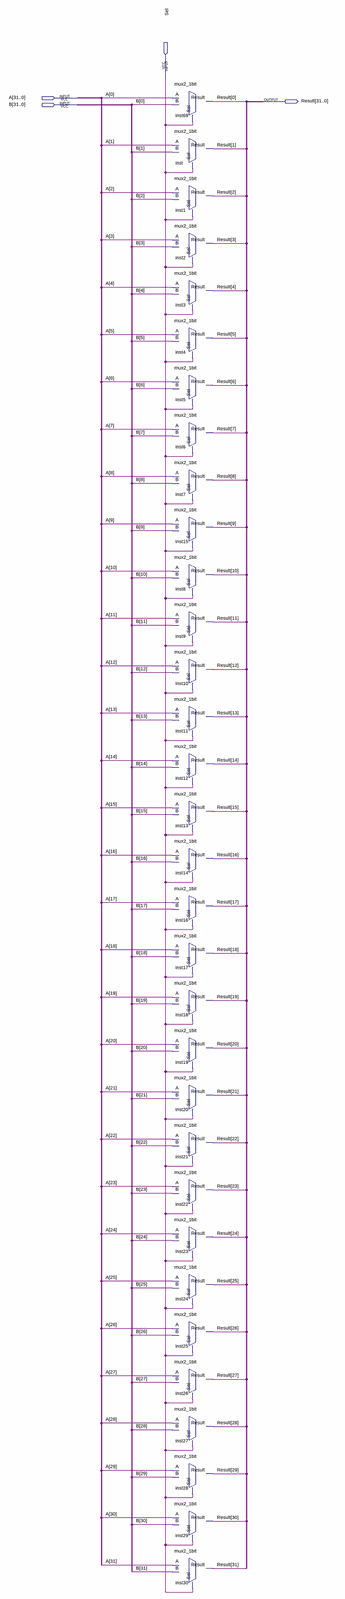
[diagram p0: schematic sheet, whole]
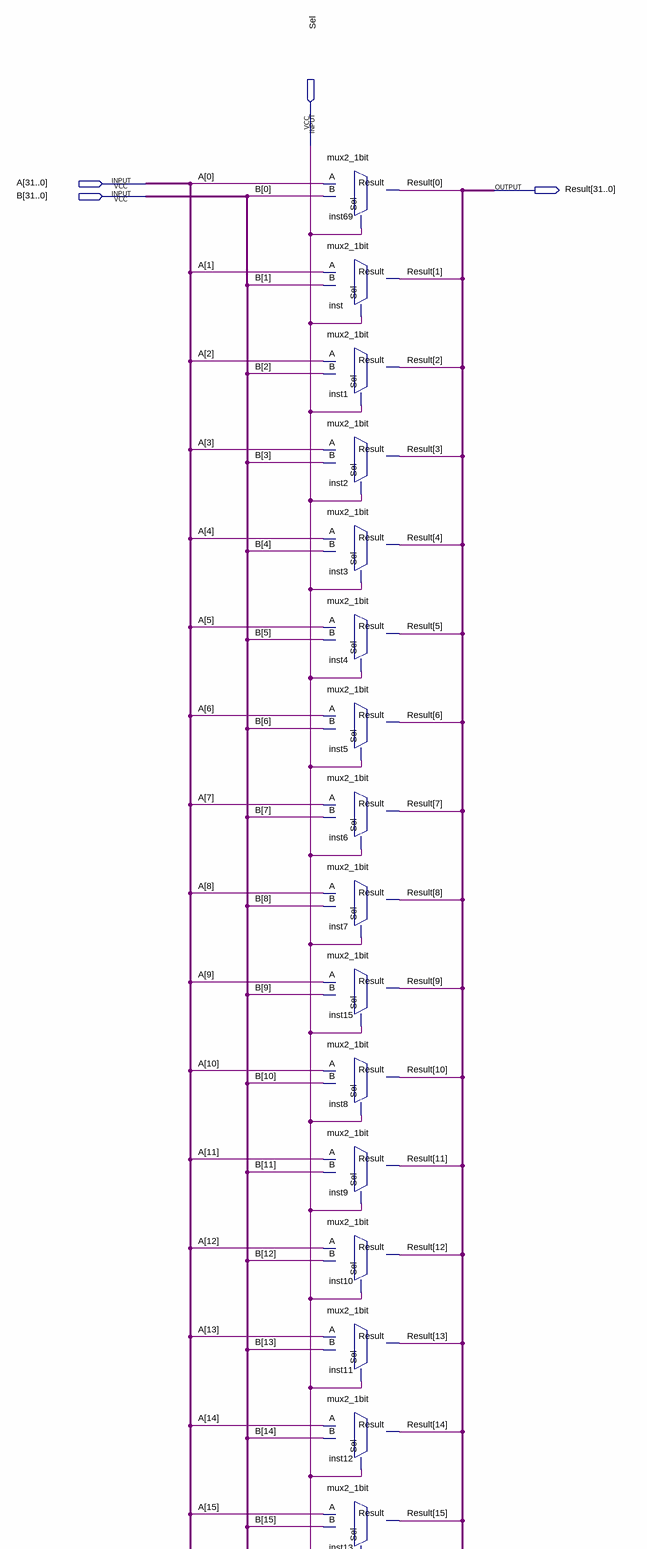
[diagram p1: schematic sheet, upper part]
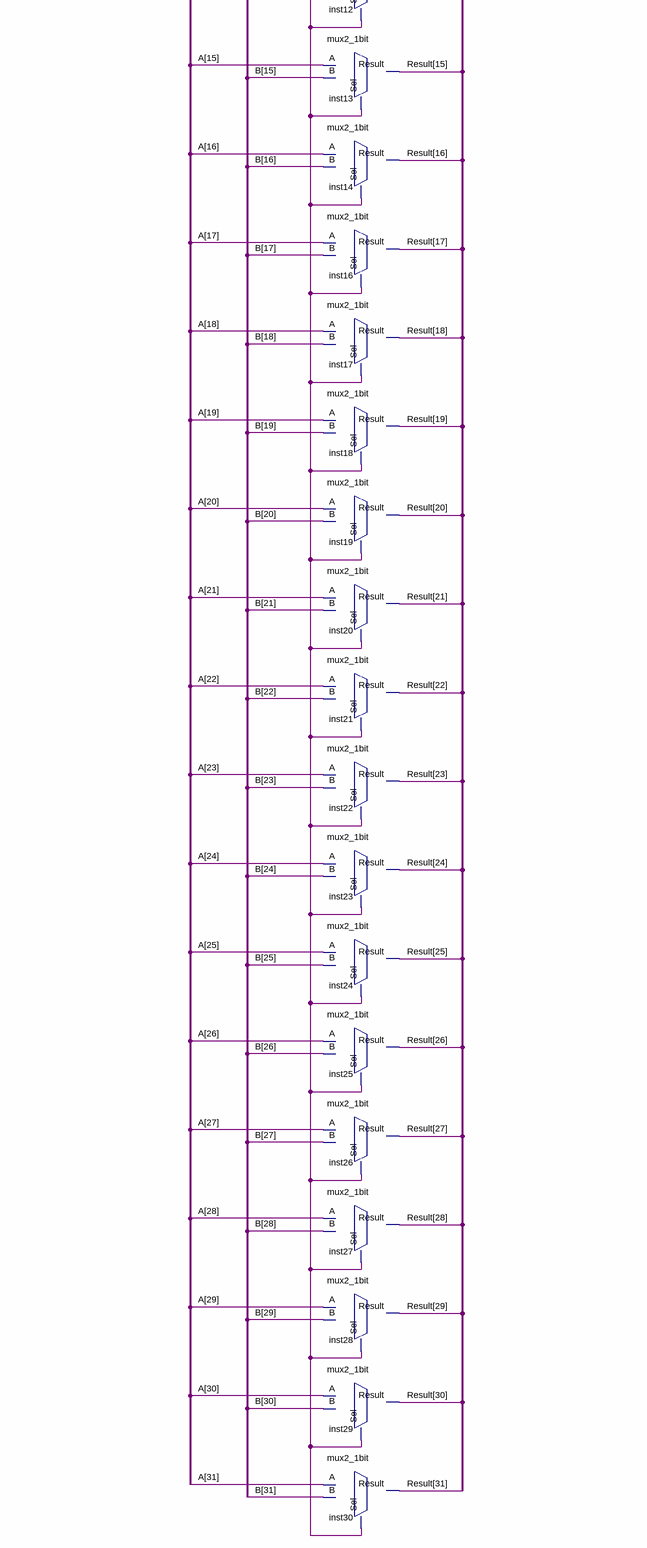
[diagram p2: schematic sheet, lower part]
// Quartus schematic mux2_32bits.bdf as structural Verilog: 32 symbols, 4 pins
module mux2_32bits (
  input  Sel,
  input  [31:0] A,
  input  [31:0] B,
  output [31:0] Result
);

  mux2_1bit inst69 (.Sel(Sel), .A(A[0]), .B(B[0]), .Result(Result[0]));
  mux2_1bit inst (.Sel(Sel), .A(A[1]), .B(B[1]), .Result(Result[1]));
  mux2_1bit inst1 (.Sel(Sel), .A(A[2]), .B(B[2]), .Result(Result[2]));
  mux2_1bit inst2 (.Sel(Sel), .A(A[3]), .B(B[3]), .Result(Result[3]));
  mux2_1bit inst3 (.Sel(Sel), .A(A[4]), .B(B[4]), .Result(Result[4]));
  mux2_1bit inst4 (.Sel(Sel), .A(A[5]), .B(B[5]), .Result(Result[5]));
  mux2_1bit inst5 (.Sel(Sel), .A(A[6]), .B(B[6]), .Result(Result[6]));
  mux2_1bit inst6 (.Sel(Sel), .A(A[7]), .B(B[7]), .Result(Result[7]));
  mux2_1bit inst7 (.Sel(Sel), .A(A[8]), .B(B[8]), .Result(Result[8]));
  mux2_1bit inst15 (.Sel(Sel), .A(A[9]), .B(B[9]), .Result(Result[9]));
  mux2_1bit inst8 (.Sel(Sel), .A(A[10]), .B(B[10]), .Result(Result[10]));
  mux2_1bit inst9 (.Sel(Sel), .A(A[11]), .B(B[11]), .Result(Result[11]));
  mux2_1bit inst10 (.Sel(Sel), .A(A[12]), .B(B[12]), .Result(Result[12]));
  mux2_1bit inst11 (.Sel(Sel), .A(A[13]), .B(B[13]), .Result(Result[13]));
  mux2_1bit inst12 (.Sel(Sel), .A(A[14]), .B(B[14]), .Result(Result[14]));
  mux2_1bit inst13 (.Sel(Sel), .A(A[15]), .B(B[15]), .Result(Result[15]));
  mux2_1bit inst14 (.Sel(Sel), .A(A[16]), .B(B[16]), .Result(Result[16]));
  mux2_1bit inst16 (.Sel(Sel), .A(A[17]), .B(B[17]), .Result(Result[17]));
  mux2_1bit inst17 (.Sel(Sel), .A(A[18]), .B(B[18]), .Result(Result[18]));
  mux2_1bit inst18 (.Sel(Sel), .A(A[19]), .B(B[19]), .Result(Result[19]));
  mux2_1bit inst19 (.Sel(Sel), .A(A[20]), .B(B[20]), .Result(Result[20]));
  mux2_1bit inst20 (.Sel(Sel), .A(A[21]), .B(B[21]), .Result(Result[21]));
  mux2_1bit inst21 (.Sel(Sel), .A(A[22]), .B(B[22]), .Result(Result[22]));
  mux2_1bit inst22 (.Sel(Sel), .A(A[23]), .B(B[23]), .Result(Result[23]));
  mux2_1bit inst23 (.Sel(Sel), .A(A[24]), .B(B[24]), .Result(Result[24]));
  mux2_1bit inst24 (.Sel(Sel), .A(A[25]), .B(B[25]), .Result(Result[25]));
  mux2_1bit inst25 (.Sel(Sel), .A(A[26]), .B(B[26]), .Result(Result[26]));
  mux2_1bit inst26 (.Sel(Sel), .A(A[27]), .B(B[27]), .Result(Result[27]));
  mux2_1bit inst27 (.Sel(Sel), .A(A[28]), .B(B[28]), .Result(Result[28]));
  mux2_1bit inst28 (.Sel(Sel), .A(A[29]), .B(B[29]), .Result(Result[29]));
  mux2_1bit inst29 (.Sel(Sel), .A(A[30]), .B(B[30]), .Result(Result[30]));
  mux2_1bit inst30 (.Sel(Sel), .A(A[31]), .B(B[31]), .Result(Result[31]));
endmodule
